# Altium schematic sheet 1.SchDoc
size A4
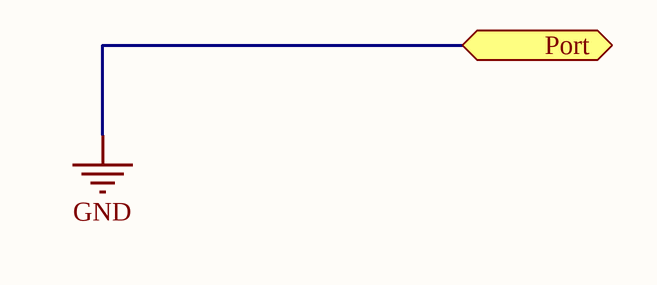
[diagram p0: 1.SchDoc]

## Ports
Port

## Nets
GND: port Port